# EAGLE design splitter (EAGLE 7.5.0)
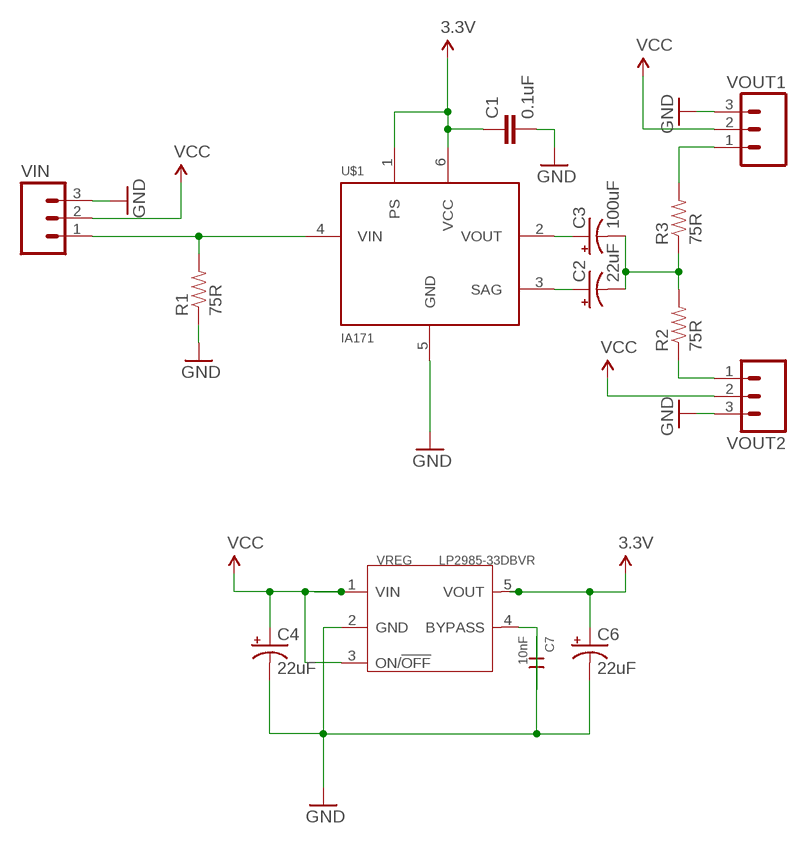
[diagram p0: schematic, sheet 1]

## Parts
C1  0.1uF  CAP0805  [0805]
C2  22uF  CAP_POL1206  [EIA3216]
C3  100uF  CAP_POL3528  [EIA3528]
C4  22uF  CAP_POL1206  [EIA3216]
C6  22uF  CAP_POL1206  [EIA3216]
C7  10nF  CERAMIC-10NF-50V-5%-X7R(0805)  [C0805]
R1  75R  RESISTOR0805-RES  [0805]
R2  75R  RESISTOR0805-RES  [0805]
R3  75R  RESISTOR0805-RES  [0805]
U$1  IA171  [SOT23-6]
VIN  M03LOCK  [1X03_LOCK]
VOUT1  M03LOCK  [1X03_LOCK]
VOUT2  M03LOCK  [1X03_LOCK]
VREG  LP2985-33DBVR  PMIC-LP2985-33DBVR(SOT23-5)  [SOT-23-5]

## Nets
3.3V: C1.1 C6.A(+) U$1.1(PS) U$1.6(VCC) VREG.5(VOUT)
GND: C1.2 C4.C(-) C6.C(-) C7.1 R1.1 U$1.5(GND) VIN.3 VOUT1.3 VOUT2.3 VREG.2(GND)
N$1: C7.2 VREG.4(BYPASS)
N$2: R2.1 VOUT2.1
N$4: R3.2 VOUT1.1
N$5: C3.A(+) U$1.2(VOUT)
N$6: C2.A(+) U$1.3(SAG)
N$7: C2.C(-) C3.C(-) R2.2 R3.1
N$8: R1.2 U$1.4(VIN) VIN.1
VCC: C4.A(+) VIN.2 VOUT1.2 VOUT2.2 VREG.1(VIN) VREG.3(ON/!OFF)

## Library data of the parts
C1 = SparkFun-Passives:CAP: Capacitor Standard 0603 ceramic capacitor, and 0.1" leaded capacitor.
C2-C4 C6 = SparkFun-Passives:CAP_POL: Capacitor Polarized These are standard SMD and PTH capacitors. Normally 10uF, 47uF, and 100uF in electrolytic and tantalum varieties. Always verify the external diameter of the through hole cap, it varies with capacity, voltage, and manufacturer. The EIA devices should be standard.
C7 = Seeed-OPL-Capacitor:CERAMIC-10NF-50V-5%-X7R(0805): 302010175; MPN: CC0805JRX7R9BB103; VALUE: 10nf
R1-R3 = SparkFun-Passives:RESISTOR: Resistor Basic schematic elements and footprints for 0603, 1206, and PTH resistors.
U$1 = User-Submitted:IA171
VIN VOUT1 VOUT2 = SparkFun-Connectors:M03: Header 3 Standard 3-pin 0.1" header. Use with straight break away headers (SKU : PRT-00116), right angle break away headers (PRT-00553), swiss pins (PRT-00743), machine pins (PRT-00117), and female headers (PRT-00115). Molex polarized connector foot print use with SKU : PRT-08232 with associated crimp pins and housings.
VREG = Seeed-OPL-ic:PMIC-LP2985-33DBVR(SOT23-5): 310030033; MPN: LP2985-33DBVR

## Board
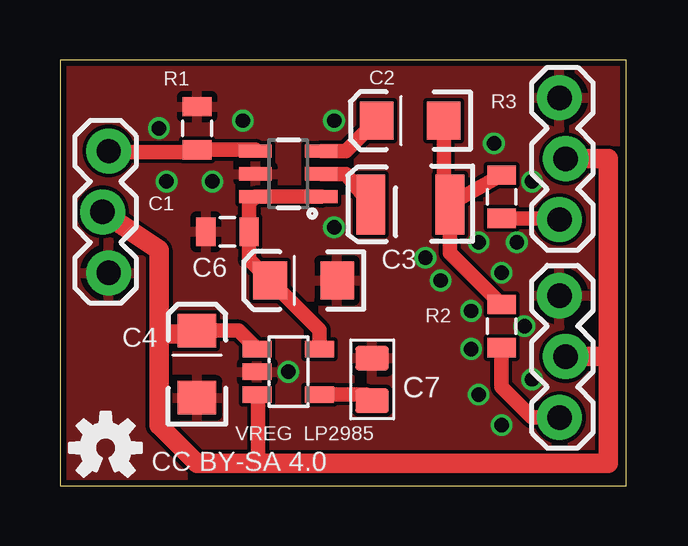
[diagram p1: board, top side]
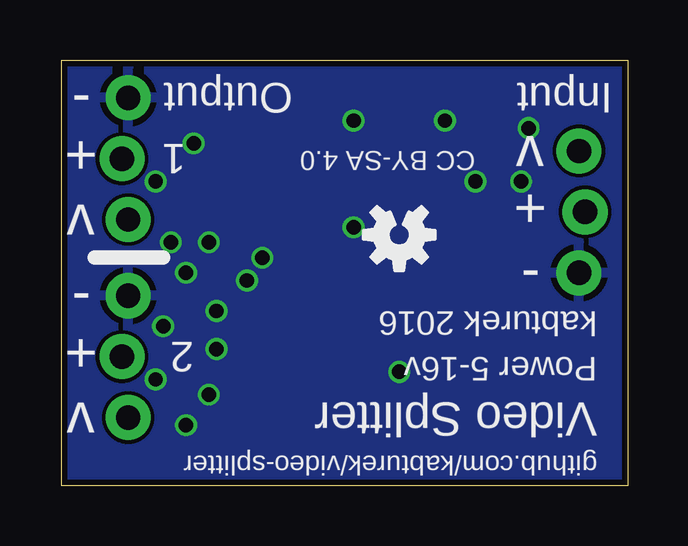
[diagram p2: board, bottom side, seen from below]

Size 23.61 x 17.77 mm. Coordinates in mm from the lower left corner, seen from the top.
Outline: 0,0 23.61,0 23.61,17.77 0,17.77 0,0
Copper layers (1*16): Top 0.035mm / dielectric 1.5mm / Bottom 0.035mm
Design rules "SeeedStudio_2layer_DRU_no_angle_20140221": minimum track width 6mil, minimum drill 12mil, track to track 6mil, track to pad 6mil, pad to pad 6mil, via to via 6mil, smd to smd 0mil, copper to edge 10mil, drill to drill 10mil, minimum pad ring 10mil, minimum via ring 6mil, stop-mask expansion 2mil, vias tented up to drill 100mil, thermal gap 10mil

### Footprints (pad centres in the part's own frame; a part is rotated, then mirrored left to right if it is on the bottom)
0805 = smd 0.8 x 1.2: 1 -0.9,0; 2 0.9,0
EIA3216 = smd 1.4 x 1.6: A 1.4,0; C -1.4,0
EIA3528 = smd 1.2 x 2.5: A 1.65,0; C -1.65,0
C0805 = smd 1.397 x 1.016: 1 0,0.889; 2 0,-0.889
SOT23-6 = smd 0.55 x 1.35: 1 -0.95,-1.375; 2 0,-1.375; 3 0.95,-1.375; 4 0.95,1.375; 5 0,1.375; 6 -0.95,1.375
1X03_LOCK = drill 1.016 pad 1.88: 1 0,0.127; 2 2.54,-0.127; 3 5.08,0.127
SOT-23-5 = smd 0.69 x 1.2: 1 -0.95,-1.3; 2 0,-1.3; 3 0.95,-1.3; 4 0.95,1.3; 5 -0.95,1.3

### Placement (x,y rotation side)
C1  6.99,10.6 180 top
C2  14.61,15.24 180 top
C3  14.61,11.75 180 top
C4  5.71,5.08 90 top
C6  10.16,8.57 180 top
C7  13.02,4.45 0 top
R1  5.71,14.92 270 top
R2  18.41,6.67 90 top
R3  18.41,12.06 270 top
U$1  9.53,13.02 90 top
U$2  [OSHW-LOGO-S]  1.91,1.59 0 top
U$3  [OSHW-LOGO-S]  9.53,10.48 180 bottom
VIN  1.91,13.97 270 top
VOUT1  20.95,11.11 90 top
VOUT2  20.95,2.86 90 top
VREG  9.53,4.76 270 top

### Tracks (layer width: path | path; a pad name or v marks a point on that pad's centre or on a via)
3.3V
  Top 0.61: U$1.1 U$1.6 7.88,11.8 C1.1 7.88,9.45 C6.A 10.82,6.51 VREG.5
GND  (via drill 0.6)
  other vias: 15.88,8.57 17.14,7.3 17.14,5.71 15.24,9.53 17.46,10.16 18.41,8.89 19.68,4.45 19.37,6.67 17.46,3.81 18.41,2.54 19.05,10.16 19.68,12.7 18.1,14.29 4.45,12.7 4.13,14.92 6.35,12.7 7.62,15.24 11.43,15.24 11.43,10.79 9.53,4.76
  pour Bottom: -1.27,-1.27 29.84,-1.27 29.84,20.32 -1.27,20.32
  pour Top: -1.27,-0.64 29.21,-0.64 29.21,19.68 -1.27,19.68
N$1
  Top 0.406: C7.2 12.76,3.81
  Top 0.61: 12.76,3.81 VREG.4
N$2
  Top 0.61: VOUT2.1 19.68,2.86 18.41,4.13 R2.1
N$4
  Top 0.61: VOUT1.1 20.78,11.16 R3.2
N$5
  Top 0.61: C3.A 11.94,13.02 U$1.2
N$6
  Top 0.61: U$1.3 11.93,13.97 C2.A
N$7
  Top 0.61: R2.2 16.25,9.73 C3.C | C3.C 16,12 C2.C | R3.1 C3.C
N$8
  Top 0.406: 8.15,14.02 U$1.4 | 5.47,13.92 R1.2
  Top 0.61: R1.2 8.15,14.02 | 5.47,13.92 2.08,13.92 VIN.1
VCC
  Top 0.61: VREG.1 7.46,6.48 C4.A | VREG.3 8.26,3.78 8.26,0.95
  Top 0.813: VOUT1.2 22.86,13.65 22.86,5.4 | VOUT2.2 22.86,5.4 | 22.86,5.4 22.86,0.95 8.26,0.95 5.71,0.95 4.13,2.54 4.13,6.35 | VIN.2 4.13,9.84 4.13,6.35 | C4.A 5.58,6.35 4.13,6.35

### Text on the board
tNames: LP2985 | CC BY-SA 4.0
bNames: Input | Output | - | v | CC BY-SA 4.0 | 1 | + | v | + | - | kabturek 2016 | - | 2 | Power 5-16v | + | Video Splitter | v | github.com/kabturek/video-splitter